# Altium project Minibot_V1.PrjPcb
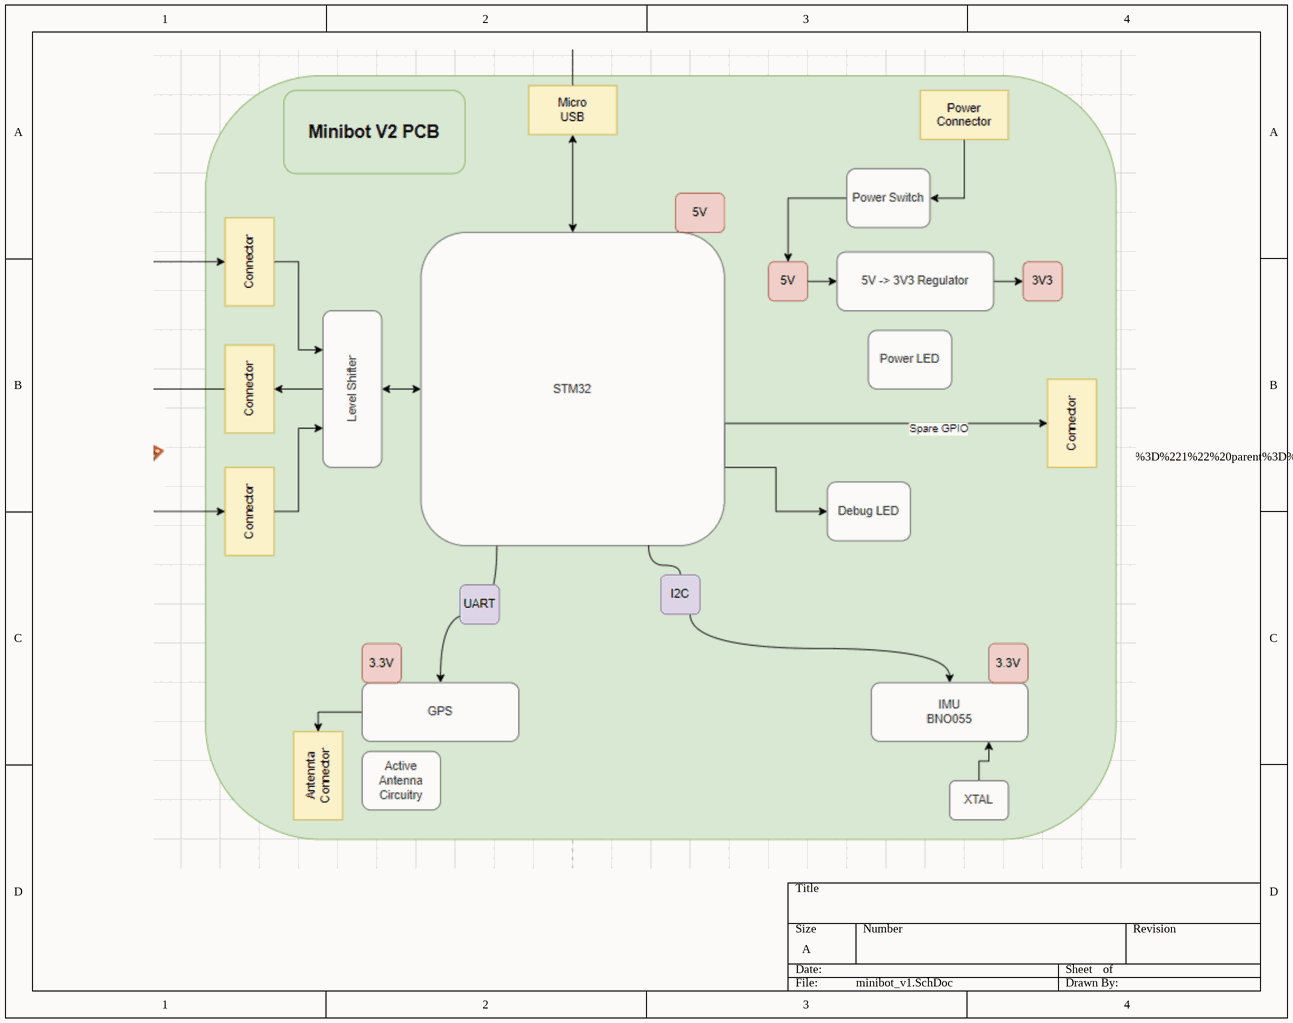
[diagram p0: minibot_v1.SchDoc]
6 sheets, 97 parts. Net scope: global (net labels, ports and power ports of the same name join across sheets).
Board file: minibot_v1.PcbDoc
Sheets:
  minibot_v1.SchDoc
  microController.SchDoc
  Connectors.SchDoc
  Sensor.SchDoc
  Power.SchDoc
  Nucleo.SchDoc

## Sheet minibot_v1.SchDoc
size A; SheetNumber: 1; SheetTotal: 4

### Notes on the sheet
- %3CmxGraphModel%3E%3Croot%3E%3CmxCell%20id%3D%220%22%2F%3E%3CmxCell%20id%3D%221%22%20parent%3D%220%22%2F%3E%3CmxCell%20id%3D%222%22%20value%3D%22%22%20style%3D%22rounded%3D1%3BwhiteSpace%3Dwrap%3Bhtml%3D1%3BfillColor%3D%23d5e8d4%3BstrokeColor%3D%2382b366%3BarcSize%3D15%3B%22%20vertex%3D%221%22%20parent%3D%221%22%3E%3CmxGeometry%20x%3D%22-375%22%20y%3D%22-820%22%20width%3D%22930%22%20height%3D%22780%22%20as%3D%22geometry%22%2F%3E%3C%2FmxCell%3E%3CmxCell%20id%3D%223%22%20style%3D%22edgeStyle%3DorthogonalEdgeStyle%3Bcurved%3D1%3BorthogonalLoop%3D1%3BjettySize%3Dauto%3Bhtml%3D1%3BexitX%3D0.25%3BexitY%3D1%3BexitDx%3D0%3BexitDy%3D0%3B%22%20edge%3D%221%22%20source%3D%229%22%20target%3D%2213%22%20parent%3D%221%22%3E%3CmxGeometry%20relative%3D%221%22%20as%3D%22geometry%22%2F%3E%3C%2FmxCell%3E%3CmxCell%20id%3D%224%22%20style%3D%22edgeStyle%3DorthogonalEdgeStyle%3Bcurved%3D1%3BorthogonalLoop%3D1%3BjettySize%3Dauto%3Bhtml%3D1%3BexitX%3D0.75%3BexitY%3D1%3BexitDx%3D0%3BexitDy%3D0%3BentryX%3D0.5%3BentryY%3D0%3BentryDx%3D0%3BentryDy%3D0%3BstartArrow%3Dnone%3B%22%20edge%3D%221%22%20source%3D%2243%22%20target%3D%2211%22%20parent%3D%221%22%3E%3CmxGeometry%20relative%3D%221%22%20as%3D%22geometry%22%2F%3E%3C%2FmxCell%3E%3CmxCell%20id%3D%225%22%20style%3D%22edgeStyle%3DorthogonalEdgeStyle%3Brounded%3D0%3BorthogonalLoop%3D1%3BjettySize%3Dauto%3Bhtml%3D1%3BexitX%3D0.5%3BexitY%3D0%3BexitDx%3D0%3BexitDy%3D0%3BentryX%3D0.5%3BentryY%3D1%3BentryDx%3D0%3BentryDy%3D0%3BstartArrow%3Dclassic%3BstartFill%3D1%3B%22%20edge%3D%221%22%20source%3D%229%22%20target%3D%2218%22%20parent%3D%221%22%3E%3CmxGeometry%20relative%3D%221%22%20as%3D%22geometry%22%2F%3E%3C%2FmxCell%3E%3CmxCell%20id%3D%226%22%20style%3D%22edgeStyle%3DorthogonalEdgeStyle%3Brounded%3D0%3BorthogonalLoop%3D1%3BjettySize%3Dauto%3Bhtml%3D1%3BexitX%3D1%3BexitY%3D0.75%3BexitDx%3D0%3BexitDy%3D0%3BentryX%3D0.5%3BentryY%3D0%3BentryDx%3D0%3BentryDy%3D0%3BstartArrow%3Dnone%3BstartFill%3D0%3B%22%20edge%3D%221%22%20source%3D%229%22%20target%3D%2237%22%20parent%3D%221%22%3E%3CmxGeometry%20relative%3D%221%22%20as%3D%22geometry%22%3E%3CArray%20as%3D%22points%22%3E%3CmxPoint%20x%3D%22155%22%20y%3D%22-465%22%2F%3E%3C%2FArray%3E%3C%2FmxGeometry%3E%3C%2FmxCell%3E%3CmxCell%20id%3D%227%22%20value%3D%22Spare%20GPIO%22%20style%3D%22edgeLabel%3Bhtml%3D1%3Balign%3Dcenter%3BverticalAlign%3Dmiddle%3Bresizable%3D0%3Bpoints%3D%5B%5D%3B%22%20connectable%3D%220%22%20vertex%3D%221%22%20parent%3D%226%22%3E%3CmxGeometry%20x%3D%220.3987%22%20y%3D%22-5%22%20relative%3D%221%22%20as%3D%22geometry%22%3E%3CmxPoint%20as%3D%22offset%22%2F%3E%3C%2FmxGeometry%3E%3C%2FmxCell%3E%3CmxCell%20id%3D%228%22%20style%3D%22edgeStyle%3DorthogonalEdgeStyle%3Brounded%3D0%3BorthogonalLoop%3D1%3BjettySize%3Dauto%3Bhtml%3D1%3BexitX%3D1%3BexitY%3D0.75%3BexitDx%3D0%3BexitDy%3D0%3B%22%20edge%3D%221%22%20source%3D%229%22%20target%3D%2239%22%20parent%3D%221%22%3E%3CmxGeometry%20relative%3D%221%22%20as%3D%22geometry%22%2F%3E%3C%2FmxCell%3E%3CmxCell%20id%3D%229%22%20value%3D%22STM32%22%20style%3D%22rounded%3D1%3BwhiteSpace%3Dwrap%3Bhtml%3D1%3BfillColor%3D%23f5f5f5%3BfontColor%3D%23333333%3BstrokeColor%3D%23666666%3B%22%20vertex%3D%221%22%20parent%3D%221%22%3E%3CmxGeometry%20x%3D%22-155%22%20y%3D%22-660%22%20width%3D%22310%22%20height%3D%22320%22%20as%3D%22geometry%22%2F%3E%3C%2FmxCell%3E%3CmxCell%20id%3D%2210%22%20value%3D%225V%22%20style%3D%22rounded%3D1%3BwhiteSpace%3Dwrap%3Bhtml%3D1%3BfillColor%3D%23f8cecc%3BstrokeColor%3D%23b85450%3B%22%20vertex%3D%221%22%20parent%3D%221%22%3E%3CmxGeometry%20x%3D%22105%22%20y%3D%22-700%22%20width%3D%2250%22%20height%3D%2240%22%20as%3D%22geometry%22%2F%3E%3C%2FmxCell%3E%3CmxCell%20id%3D%2211%22%20value%3D%22IMU%26lt%3Bbr%26gt%3BBNO055%22%20style%3D%22rounded%3D1%3BwhiteSpace%3Dwrap%3Bhtml%3D1%3BfillColor%3D%23f5f5f5%3BfontColor%3D%23333333%3BstrokeColor%3D%23666666%3B%22%20vertex%3D%221%22%20parent%3D%221%22%3E%3CmxGeometry%20x%3D%22305%22%20y%3D%22-200%22%20width%3D%22160%22%20height%3D%2260%22%20as%3D%22geometry%22%2F%3E%3C%2FmxCell%3E%3CmxCell%20id%3D%2212%22%20style%3D%22edgeStyle%3DorthogonalEdgeStyle%3Brounded%3D0%3BorthogonalLoop%3D1%3BjettySize%3Dauto%3Bhtml%3D1%3BexitX%3D0%3BexitY%3D0.5%3BexitDx%3D0%3BexitDy%3D0%3BentryX%3D1%3BentryY%3D0.5%3BentryDx%3D0%3BentryDy%3D0%3BstartArrow%3Dnone%3BstartFill%3D0%3B%22%20edge%3D%221%22%20source%3D%2213%22%20target%3D%2236%22%20parent%3D%221%22%3E%3CmxGeometry%20relative%3D%221%22%20as%3D%22geometry%22%2F%3E%3C%2FmxCell%3E%3CmxCell%20id%3D%2213%22%20value%3D%22GPS%22%20style%3D%22rounded%3D1%3BwhiteSpace%3Dwrap%3Bhtml%3D1%3BfillColor%3D%23f5f5f5%3BfontColor%3D%23333333%3BstrokeColor%3D%23666666%3B%22%20vertex%3D%221%22%20parent%3D%221%22%3E%3CmxGeometry%20x%3D%22-215%22%20y%3D%22-200%22%20width%3D%22160%22%20height%3D%2260%22%20as%3D%22geometry%22%2F%3E%3C%2FmxCell%3E%3CmxCell%20id%3D%2214%22%20value%3D%22UART%22%20style%3D%22rounded%3D1%3BwhiteSpace%3Dwrap%3Bhtml%3D1%3BfillColor%3D%23e1d5e7%3BstrokeColor%3D%239673a6%3B%22%20vertex%3D%221%22%20parent%3D%221%22%3E%3CmxGeometry%20x%3D%22-115%22%20y%3D%22-300%22%20width%3D%2240%22%20height%3D%2240%22%20as%3D%22geometry%22%2F%3E%3C%2FmxCell%3E%3CmxCell%20id%3D%2215%22%20value%3D%223.3V%22%20style%3D%22rounded%3D1%3BwhiteSpace%3Dwrap%3Bhtml%3D1%3BfillColor%3D%23f8cecc%3BstrokeColor%3D%23b85450%3B%22%20vertex%3D%221%22%20parent%3D%221%22%3E%3CmxGeometry%20x%3D%22425%22%20y%3D%22-240%22%20width%3D%2240%22%20height%3D%2240%22%20as%3D%22geometry%22%2F%3E%3C%2FmxCell%3E%3CmxCell%20id%3D%2216%22%20value%3D%223.3V%22%20style%3D%22rounded%3D1%3BwhiteSpace%3Dwrap%3Bhtml%3D1%3BfillColor%3D%23f8cecc%3BstrokeColor%3D%23b85450%3B%22%20vertex%3D%221%22%20parent%3D%221%22%3E%3CmxGeometry%20x%3D%22-215%22%20y%3D%22-240%22%20width%3D%2240%22%20height%3D%2240%22%20as%3D%22geometry%22%2F%3E%3C%2FmxCell%3E%3CmxCell%20id%3D%2217%22%20value%3D%22Connector%22%20style%3D%22rounded%3D0%3BwhiteSpace%3Dwrap%3Bhtml%3D1%3Brotation%3D-90%3BfillColor%3D%23fff2cc%3BstrokeColor%3D%23d6b656%3B%22%20vertex%3D%221%22%20parent%3D%221%22%3E%3CmxGeometry%20x%3D%22-375%22%20y%3D%22-525%22%20width%3D%2290%22%20height%3D%2250%22%20as%3D%22geometry%22%2F%3E%3C%2FmxCell%3E%3CmxCell%20id%3D%2218%22%20value%3D%22Micro%20%26lt%3Bbr%26gt%3BUSB%22%20style%3D%22rounded%3D0%3BwhiteSpace%3Dwrap%3Bhtml%3D1%3Brotation%3D0%3BfillColor%3D%23fff2cc%3BstrokeColor%3D%23d6b656%3B%22%20vertex%3D%221%22%20parent%3D%221%22%3E%3CmxGeometry%20x%3D%22-45%22%20y%3D%22-810%22%20width%3D%2290%22%20height%3D%2250%22%20as%3D%22geometry%22%2F%3E%3C%2FmxCell%3E%3CmxCell%20id%3D%2219%22%20style%3D%22edgeStyle%3DorthogonalEdgeStyle%3Brounded%3D0%3BorthogonalLoop%3D1%3BjettySize%3Dauto%3Bhtml%3D1%3BexitX%3D0.5%3BexitY%3D1%3BexitDx%3D0%3BexitDy%3D0%3BentryX%3D1%3BentryY%3D0.5%3BentryDx%3D0%3BentryDy%3D0%3B%22%20edge%3D%221%22%20source%3D%2220%22%20target%3D%2241%22%20parent%3D%221%22%3E%3CmxGeometry%20relative%3D%221%22%20as%3D%22geometry%22%2F%3E%3C%2FmxCell%3E%3CmxCell%20id%3D%2220%22%20value%3D%22Power%20Connector%22%20style%3D%22rounded%3D0%3BwhiteSpace%3Dwrap%3Bhtml%3D1%3Brotation%3D0%3BfillColor%3D%23fff2cc%3BstrokeColor%3D%23d6b656%3B%22%20vertex%3D%221%22%20parent%3D%221%22%3E%3CmxGeometry%20x%3D%22355%22%20y%3D%22-805%22%20width%3D%2290%22%20height%3D%2250%22%20as%3D%22geometry%22%2F%3E%3C%2FmxCell%3E%3CmxCell%20id%3D%2221%22%20style%3D%22edgeStyle%3DorthogonalEdgeStyle%3Brounded%3D0%3BorthogonalLoop%3D1%3BjettySize%3Dauto%3Bhtml%3D1%3BexitX%3D0.5%3BexitY%3D1%3BexitDx%3D0%3BexitDy%3D0%3BentryX%3D0.75%3BentryY%3D0%3BentryDx%3D0%3BentryDy%3D0%3B%22%20edge%3D%221%22%20source%3D%2222%22%20target%3D%2227%22%20parent%3D%221%22%3E%3CmxGeometry%20relative%3D%221%22%20as%3D%22geometry%22%2F%3E%3C%2FmxCell%3E%3CmxCell%20id%3D%2222%22%20value%3D%22Connector%22%20style%3D%22rounded%3D0%3BwhiteSpace%3Dwrap%3Bhtml%3D1%3Brotation%3D-90%3BfillColor%3D%23fff2cc%3BstrokeColor%3D%23d6b656%3B%22%20vertex%3D%221%22%20parent%3D%221%22%3E%3CmxGeometry%20x%3D%22-375%22%20y%3D%22-655%22%20width%3D%2290%22%20height%3D%2250%22%20as%3D%22geometry%22%2F%3E%3C%2FmxCell%3E%3CmxCell%20id%3D%2223%22%20style%3D%22edgeStyle%3DorthogonalEdgeStyle%3Brounded%3D0%3BorthogonalLoop%3D1%3BjettySize%3Dauto%3Bhtml%3D1%3BentryX%3D0.25%3BentryY%3D0%3BentryDx%3D0%3BentryDy%3D0%3B%22%20edge%3D%221%22%20source%3D%2224%22%20target%3D%2227%22%20parent%3D%221%22%3E%3CmxGeometry%20relative%3D%221%22%20as%3D%22geometry%22%2F%3E%3C%2FmxCell%3E%3CmxCell%20id%3D%2224%22%20value%3D%22Connector%22%20style%3D%22rounded%3D0%3BwhiteSpace%3Dwrap%3Bhtml%3D1%3Brotation%3D-90%3BfillColor%3D%23fff2cc%3BstrokeColor%3D%23d6b656%3B%22%20vertex%3D%221%22%20parent%3D%221%22%3E%3CmxGeometry%20x%3D%22-375%22%20y%3D%22-400%22%20width%3D%2290%22%20height%3D%2250%22%20as%3D%22geometry%22%2F%3E%3C%2FmxCell%3E%3CmxCell%20id%3D%2225%22%20style%3D%22edgeStyle%3DorthogonalEdgeStyle%3Brounded%3D0%3BorthogonalLoop%3D1%3BjettySize%3Dauto%3Bhtml%3D1%3BexitX%3D0.5%3BexitY%3D0%3BexitDx%3D0%3BexitDy%3D0%3B%22%20edge%3D%221%22%20source%3D%2227%22%20target%3D%2217%22%20parent%3D%221%22%3E%3CmxGeometry%20relative%3D%221%22%20as%3D%22geometry%22%2F%3E%3C%2FmxCell%3E%3CmxCell%20id%3D%2226%22%20style%3D%22edgeStyle%3DorthogonalEdgeStyle%3Brounded%3D0%3BorthogonalLoop%3D1%3BjettySize%3Dauto%3Bhtml%3D1%3BexitX%3D0.5%3BexitY%3D1%3BexitDx%3D0%3BexitDy%3D0%3BentryX%3D0%3BentryY%3D0.5%3BentryDx%3D0%3BentryDy%3D0%3BstartArrow%3Dclassic%3BstartFill%3D1%3B%22%20edge%3D%221%22%20source%3D%2227%22%20target%3D%229%22%20parent%3D%221%22%3E%3CmxGeometry%20relative%3D%221%22%20as%3D%22geometry%22%3E%3CArray%20as%3D%22points%22%3E%3CmxPoint%20x%3D%22-185%22%20y%3D%22-500%22%2F%3E%3CmxPoint%20x%3D%22-185%22%20y%3D%22-500%22%2F%3E%3C%2FArray%3E%3C%2FmxGeometry%3E%3C%2FmxCell%3E%3CmxCell%20id%3D%2227%22%20value%3D%22Level%20Shifter%22%20style%3D%22rounded%3D1%3BwhiteSpace%3Dwrap%3Bhtml%3D1%3BfillColor%3D%23f5f5f5%3BfontColor%3D%23333333%3BstrokeColor%3D%23666666%3Brotation%3D-90%3B%22%20vertex%3D%221%22%20parent%3D%221%22%3E%3CmxGeometry%20x%3D%22-305%22%20y%3D%22-530%22%20width%3D%22160%22%20height%3D%2260%22%20as%3D%22geometry%22%2F%3E%3C%2FmxCell%3E%3CmxCell%20id%3D%2228%22%20style%3D%22edgeStyle%3DorthogonalEdgeStyle%3Bcurved%3D1%3BorthogonalLoop%3D1%3BjettySize%3Dauto%3Bhtml%3D1%3BexitX%3D1%3BexitY%3D0.5%3BexitDx%3D0%3BexitDy%3D0%3BentryX%3D0%3BentryY%3D0.5%3BentryDx%3D0%3BentryDy%3D0%3B%22%20edge%3D%221%22%20source%3D%2229%22%20target%3D%2231%22%20parent%3D%221%22%3E%3CmxGeometry%20relative%3D%221%22%20as%3D%22geometry%22%2F%3E%3C%2FmxCell%3E%3CmxCell%20id%3D%2229%22%20value%3D%225V%22%20style%3D%22rounded%3D1%3BwhiteSpace%3Dwrap%3Bhtml%3D1%3BfillColor%3D%23f8cecc%3BstrokeColor%3D%23b85450%3B%22%20vertex%3D%221%22%20parent%3D%221%22%3E%3CmxGeometry%20x%3D%22200%22%20y%3D%22-630%22%20width%3D%2240%22%20height%3D%2240%22%20as%3D%22geometry%22%2F%3E%3C%2FmxCell%3E%3CmxCell%20id%3D%2230%22%20style%3D%22edgeStyle%3DorthogonalEdgeStyle%3Bcurved%3D1%3BorthogonalLoop%3D1%3BjettySize%3Dauto%3Bhtml%3D1%3BexitX%3D1%3BexitY%3D0.5%3BexitDx%3D0%3BexitDy%3D0%3BentryX%3D0%3BentryY%3D0.5%3BentryDx%3D0%3BentryDy%3D0%3B%22%20edge%3D%221%22%20source%3D%2231%22%20target%3D%2232%22%20parent%3D%221%22%3E%3CmxGeometry%20relative%3D%221%22%20as%3D%22geometry%22%2F%3E%3C%2FmxCell%3E%3CmxCell%20id%3D%2231%22%20value%3D%225V%20-%26amp%3Bgt%3B%203V3%20Regulator%22%20style%3D%22rounded%3D1%3BwhiteSpace%3Dwrap%3Bhtml%3D1%3BfillColor%3D%23f5f5f5%3BfontColor%3D%23333333%3BstrokeColor%3D%23666666%3B%22%20vertex%3D%221%22%20parent%3D%221%22%3E%3CmxGeometry%20x%3D%22270%22%20y%3D%22-640%22%20width%3D%22160%22%20height%3D%2260%22%20as%3D%22geometry%22%2F%3E%3C%2FmxCell%3E%3CmxCell%20id%3D%2232%22%20value%3D%223V3%22%20style%3D%22rounded%3D1%3BwhiteSpace%3Dwrap%3Bhtml%3D1%3BfillColor%3D%23f8cecc%3BstrokeColor%3D%23b85450%3B%22%20vertex%3D%221%22%20parent%3D%221%22%3E%3CmxGeometry%20x%3D%22460%22%20y%3D%22-630%22%20width%3D%2240%22%20height%3D%2240%22%20as%3D%22geometry%22%2F%3E%3C%2FmxCell%3E%3CmxCell%20id%3D%2233%22%20style%3D%22edgeStyle%3DorthogonalEdgeStyle%3Brounded%3D0%3BorthogonalLoop%3D1%3BjettySize%3Dauto%3Bhtml%3D1%3BexitX%3D0.5%3BexitY%3D0%3BexitDx%3D0%3BexitDy%3D0%3BentryX%3D0.75%3BentryY%3D1%3BentryDx%3D0%3BentryDy%3D0%3BstartArrow%3Dnone%3BstartFill%3D0%3B%22%20edge%3D%221%22%20source%3D%2234%22%20target%3D%2211%22%20parent%3D%221%22%3E%3CmxGeometry%20relative%3D%221%22%20as%3D%22geometry%22%2F%3E%3C%2FmxCell%3E%3CmxCell%20id%3D%2234%22%20value%3D%22XTAL%22%20style%3D%22rounded%3D1%3BwhiteSpace%3Dwrap%3Bhtml%3D1%3BfillColor%3D%23f5f5f5%3BfontColor%3D%23333333%3BstrokeColor%3D%23666666%3B%22%20vertex%3D%221%22%20parent%3D%221%22%3E%3CmxGeometry%20x%3D%22385%22%20y%3D%22-100%22%20width%3D%2260%22%20height%3D%2240%22%20as%3D%22geometry%22%2F%3E%3C%2FmxCell%3E%3CmxCell%20id%3D%2235%22%20value%3D%22Active%20Antenna%20Circuitry%22%20style%3D%22rounded%3D1%3BwhiteSpace%3Dwrap%3Bhtml%3D1%3BfillColor%3D%23f5f5f5%3BfontColor%3D%23333333%3BstrokeColor%3D%23666666%3B%22%20vertex%3D%221%22%20parent%3D%221%22%3E%3CmxGeometry%20x%3D%22-215%22%20y%3D%22-130%22%20width%3D%2280%22%20height%3D%2260%22%20as%3D%22geometry%22%2F%3E%3C%2FmxCell%3E%3CmxCell%20id%3D%2236%22%20value%3D%22Antennta%20Connector%22%20style%3D%22rounded%3D0%3BwhiteSpace%3Dwrap%3Bhtml%3D1%3Brotation%3D-90%3BfillColor%3D%23fff2cc%3BstrokeColor%3D%23d6b656%3B%22%20vertex%3D%221%22%20parent%3D%221%22%3E%3CmxGeometry%20x%3D%22-305%22%20y%3D%22-130%22%20width%3D%2290%22%20height%3D%2250%22%20as%3D%22geometry%22%2F%3E%3C%2FmxCell%3E%3CmxCell%20id%3D%2237%22%20value%3D%22Connector%22%20style%3D%22rounded%3D0%3BwhiteSpace%3Dwrap%3Bhtml%3D1%3Brotation%3D-90%3BfillColor%3D%23fff2cc%3BstrokeColor%3D%23d6b656%3B%22%20vertex%3D%221%22%20parent%3D%221%22%3E%3CmxGeometry%20x%3D%22465%22%20y%3D%22-490%22%20width%3D%2290%22%20height%3D%2250%22%20as%3D%22geometry%22%2F%3E%3C%2FmxCell%3E%3CmxCell%20id%3D%2238%22%20value%3D%22Power%20LED%22%20style%3D%22rounded%3D1%3BwhiteSpace%3Dwrap%3Bhtml%3D1%3BfillColor%3D%23f5f5f5%3BfontColor%3D%23333333%3BstrokeColor%3D%23666666%3B%22%20vertex%3D%221%22%20parent%3D%221%22%3E%3CmxGeometry%20x%3D%22302%22%20y%3D%22-560%22%20width%3D%2285%22%20height%3D%2260%22%20as%3D%22geometry%22%2F%3E%3C%2FmxCell%3E%3CmxCell%20id%3D%2239%22%20value%3D%22Debug%20LED%22%20style%3D%22rounded%3D1%3BwhiteSpace%3Dwrap%3Bhtml%3D1%3BfillColor%3D%23f5f5f5%3BfontColor%3D%23333333%3BstrokeColor%3D%23666666%3B%22%20vertex%3D%221%22%20parent%3D%221%22%3E%3CmxGeometry%20x%3D%22260%22%20y%3D%22-405%22%20width%3D%2285%22%20height%3D%2260%22%20as%3D%22geometry%22%2F%3E%3C%2FmxCell%3E%3CmxCell%20id%3D%2240%22%20style%3D%22edgeStyle%3DorthogonalEdgeStyle%3Brounded%3D0%3BorthogonalLoop%3D1%3BjettySize%3Dauto%3Bhtml%3D1%3BexitX%3D0%3BexitY%3D0.5%3BexitDx%3D0%3BexitDy%3D0%3BentryX%3D0.5%3BentryY%3D0%3BentryDx%3D0%3BentryDy%3D0%3B%22%20edge%3D%221%22%20source%3D%2241%22%20target%3D%2229%22%20parent%3D%221%22%3E%3CmxGeometry%20relative%3D%221%22%20as%3D%22geometry%22%2F%3E%3C%2FmxCell%3E%3CmxCell%20id%3D%2241%22%20value%3D%22Power%20Switch%22%20style%3D%22rounded%3D1%3BwhiteSpace%3Dwrap%3Bhtml%3D1%3BfillColor%3D%23f5f5f5%3BfontColor%3D%23333333%3BstrokeColor%3D%23666666%3B%22%20vertex%3D%221%22%20parent%3D%221%22%3E%3CmxGeometry%20x%3D%22280%22%20y%3D%22-725%22%20width%3D%2285%22%20height%3D%2260%22%20as%3D%22geometry%22%2F%3E%3C%2FmxCell%3E%3CmxCell%20id%3D%2242%22%20value%3D%22%22%20style%3D%22edgeStyle%3DorthogonalEdgeStyle%3Bcurved%3D1%3BorthogonalLoop%3D1%3BjettySize%3Dauto%3Bhtml%3D1%3BexitX%3D0.75%3BexitY%3D1%3BexitDx%3D0%3BexitDy%3D0%3BentryX%3D0.5%3BentryY%3D0%3BentryDx%3D0%3BentryDy%3D0%3BendArrow%3Dnone%3B%22%20edge%3D%221%22%20source%3D%229%22%20target%3D%2243%22%20parent%3D%221%22%3E%3CmxGeometry%20relative%3D%221%22%20as%3D%22geometry%22%3E%3CmxPoint%20x%3D%2277.5%22%20y%3D%22-340%22%20as%3D%22sourcePoint%22%2F%3E%3CmxPoint%20x%3D%22385%22%20y%3D%22-200%22%20as%3D%22targetPoint%22%2F%3E%3C%2FmxGeometry%3E%3C%2FmxCell%3E%3CmxCell%20id%3D%2243%22%20value%3D%22I2C%22%20style%3D%22rounded%3D1%3BwhiteSpace%3Dwrap%3Bhtml%3D1%3BfillColor%3D%23e1d5e7%3BstrokeColor%3D%239673a6%3B%22%20vertex%3D%221%22%20parent%3D%221%22%3E%3CmxGeometry%20x%3D%2290%22%20y%3D%22-310%22%20width%3D%2240%22%20height%3D%2240%22%20as%3D%22geometry%22%2F%3E%3C%2FmxCell%3E%3CmxCell%20id%3D%2244%22%20value%3D%22%26lt%3Bfont%20style%3D%26quot%3Bfont-size%3A%2018px%3B%26quot%3B%26gt%3B%26lt%3Bb%26gt%3BMinibot%20V2%20PCB%26lt%3B%2Fb%26gt%3B%26lt%3B%2Ffont%26gt%3B%22%20style%3D%22rounded%3D1%3BwhiteSpace%3Dwrap%3Bhtml%3D1%3BfillColor%3D%23d5e8d4%3BstrokeColor%3D%2382b366%3B%22%20vertex%3D%221%22%20parent%3D%221%22%3E%3CmxGeometry%20x%3D%22-295%22%20y%3D%22-805%22%20width%3D%22185%22%20height%3D%2285%22%20as%3D%22geometry%22%2F%3E%3C%2FmxCell%3E%3C%2Froot%3E%3C%2FmxGraphModel%3E

## Sheet microController.SchDoc
size A; SheetNumber: 2; SheetTotal: 5
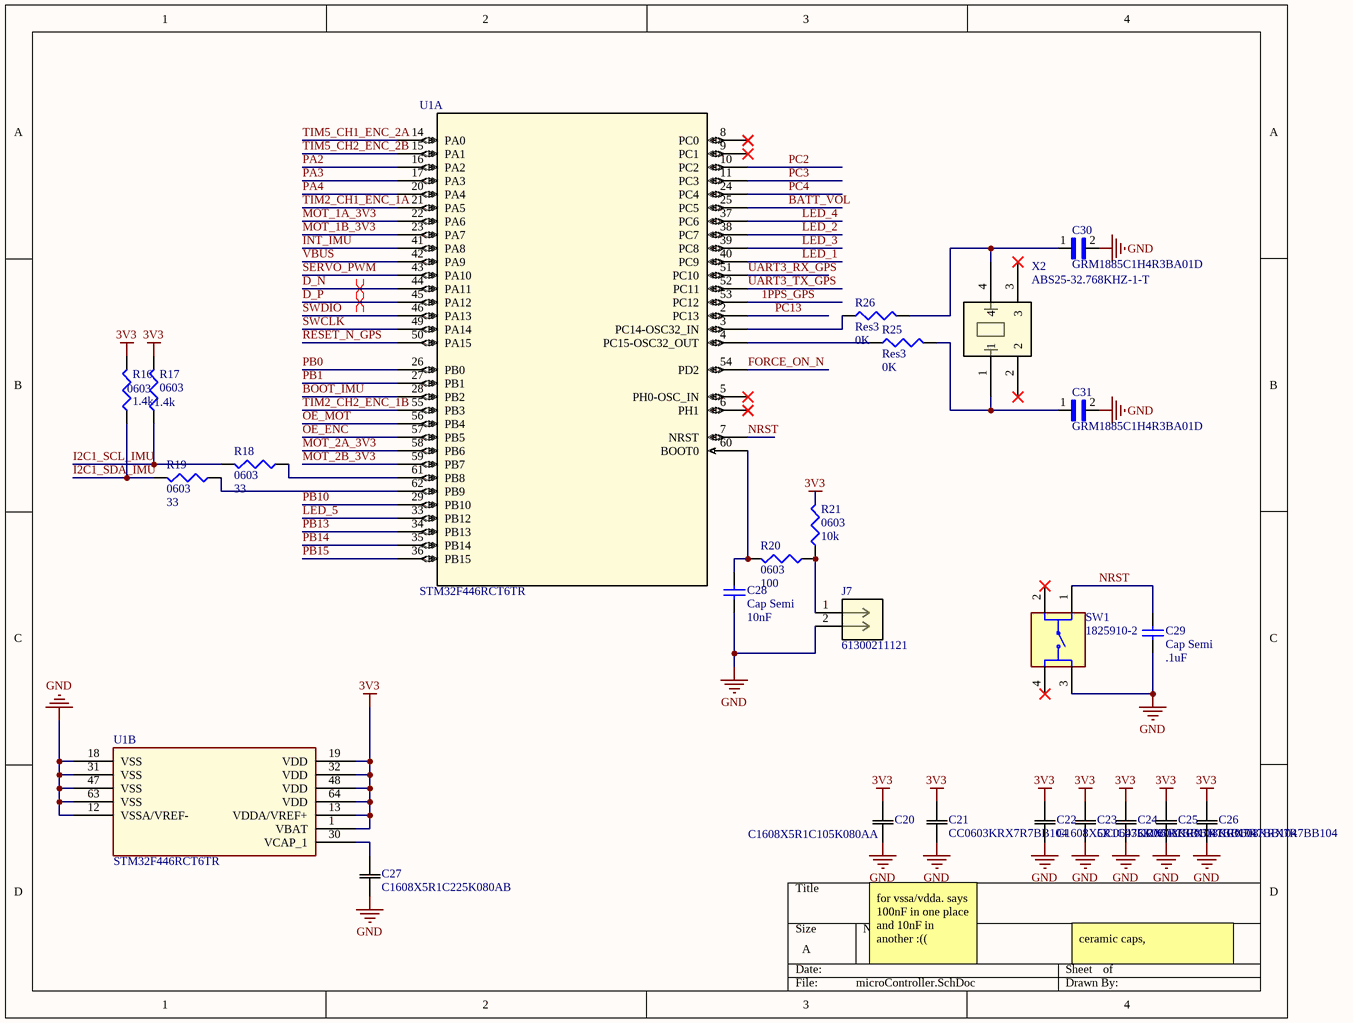
[diagram p1: microController.SchDoc]

### Parts
C20  C1608X5R1C105K080AA  [CAP_1608_TDK]
C21  CC0603KRX7R7BB104  [CC0603N_YAG]
C22  C1608X5R1C475K080AC  [CAP_1608_TDK]
C23  CC0603KRX7R7BB104  [CC0603N_YAG]
C24  CC0603KRX7R7BB104  [CC0603N_YAG]
C25  CC0603KRX7R7BB104  [CC0603N_YAG]
C26  CC0603KRX7R7BB104  [CC0603N_YAG]
C27  C1608X5R1C225K080AB  [CAP_1608_TDK]
C28  Cap Semi  value 10nF  [1608[0603]]
C29  Cap Semi  value .1uF  [1608[0603]]
C30  GRM1885C1H4R3BA01D  [CAPC1608X90N]
C31  GRM1885C1H4R3BA01D  [CAPC1608X90N]
J7  61300211121  [CONN_61300211121_WRE]
R16  0603  value 1.4k  [J1-0603]
R17  0603  value 1.4k  [J1-0603]
R18  0603  value 33  [J1-0603]
R19  0603  value 33  [J1-0603]
R20  0603  value 100  [J1-0603]
R21  0603  value 10k  [J1-0603]
R25  Res3  value 0K  [J1-0603]
R26  Res3  value 0K  [J1-0603]
SW1  1825910-2  [TE_1825910-2]
U1  STM32F446RCT6TR  [LQFP64-10x10mm]  (parts A,B of 2)
X2  ABS25-32.768KHZ-1-T  [ABS25-32.768KHZ-1-T_ABR]

### Nets
3V3: C20.2 C21.2 C22.2 C23.2 C24.2 C25.2 C26.2 R16.2 R17.2 R21.2 U1.1(VBAT) U1.13(VDDA/VREF+) U1.19(VDD) U1.32(VDD) U1.48(VDD) U1.64(VDD)
GND: C20.1 C21.1 C22.1 C23.1 C24.1 C25.1 C26.1 C27.1 C28.1 C29.1 C30.2 C31.2 J7.2 SW1.3 U1.12(VSSA/VREF-) U1.18(VSS) U1.31(VSS) U1.47(VSS) U1.63(VSS)
1PPS_GPS: U1.53(PC12)
BATT_VOL: U1.25(PC5)
BOOT_IMU: U1.28(PB2)
D_N: U1.44(PA11)
D_P: U1.45(PA12)
FORCE_ON_N: U1.54(PD2)
I2C1_SCL_IMU: R17.1 R18.2
I2C1_SDA_IMU: R16.1 R19.2
INT_IMU: U1.41(PA8)
LED_1: U1.40(PC9)
LED_2: U1.38(PC7)
LED_3: U1.39(PC8)
LED_4: U1.37(PC6)
LED_5: U1.33(PB12)
MOT_1A_3V3: U1.22(PA6)
MOT_1B_3V3: U1.23(PA7)
MOT_2A_3V3: U1.58(PB6)
MOT_2B_3V3: U1.59(PB7)
NRST: C29.2 SW1.1 U1.7(NRST)
OE_ENC: U1.57(PB5)
OE_MOT: U1.56(PB4)
PA2: U1.16(PA2)
PA3: U1.17(PA3)
PA4: U1.20(PA4)
PB0: U1.26(PB0)
PB1: U1.27(PB1)
PB10: U1.29(PB10)
PB13: U1.34(PB13)
PB14: U1.35(PB14)
PB15: U1.36(PB15)
PC2: U1.10(PC2)
PC3: U1.11(PC3)
PC4: U1.24(PC4)
PC13: U1.2(PC13)
RESET_N_GPS: U1.50(PA15)
SERVO_PWM: U1.43(PA10)
SWCLK: U1.49(PA14)
SWDIO: U1.46(PA13)
TIM2_CH1_ENC_1A: U1.21(PA5)
TIM2_CH2_ENC_1B: U1.55(PB3)
TIM5_CH1_ENC_2A: U1.14(PA0)
TIM5_CH2_ENC_2B: U1.15(PA1)
UART3_RX_GPS: U1.51(PC10)
UART3_TX_GPS: U1.52(PC11)
VBUS: U1.42(PA9)
NetC27_2: C27.2 U1.30(VCAP_1)
NetC28_2: C28.2 R20.2 U1.60(BOOT0)
NetC30_1: C30.1 R26.2 X2.4
NetC31_1: C31.1 R25.2 X2.1
NetJ7_1: J7.1 R20.1 R21.1
NetR18_1: R18.1 U1.61(PB8)
NetR19_1: R19.1 U1.62(PB9)
NetR25_1: R25.1 U1.4(PC15-OSC32_OUT)
NetR26_1: R26.1 U1.3(PC14-OSC32_IN)

Not connected (* = marked no-connect by the designer): SW1 2* 4*; U1 5(PH0-OSC_IN)* 6(PH1)* 8(PC0)* 9(PC1)*; X2 2* 3*

### Layout directives
differential pair: D_N, D_P

### Notes on the sheet
- for vssa/vdda. says 100nF in one place and 10nF in another :((
- ceramic caps,

### Library data of the parts
C20 = C1608X5R1C105K080AA: No Description Available; Mfr_Name: TDK; Type: DEV; Copyright: Copyright (C) 2023 Ultra Librarian. All rights reserved.; Manufacturer_Part_Number: C1608X5R1C105K080AA; Digi-Key_Part_Number_1: 445-1416-1-ND; Digi-Key_Part_Number_2: 445-1416-2-ND; Digi-Key_Part_Number_3: 445-1416-6-ND; RefDes: RefDes
C21 C23-C26 = CC0603KRX7R7BB104: No Description Available; Mfr_Name: Yageo; Type: DEV; Copyright: Copyright (C) 2023 Ultra Librarian. All rights reserved.; Manufacturer_Part_Number: CC0603KRX7R7BB104; Digi-Key_Part_Number_1: 311-1088-1-ND; Digi-Key_Part_Number_2: 311-1088-2-ND; Digi-Key_Part_Number_3: 311-1088-2-NDL; Digi-Key_Part_Number_4: 311-1088-6-ND; RefDes: RefDes
C22 = C1608X5R1C475K080AC: No Description Available; Mfr_Name: TDK; Type: DEV; Copyright: Copyright (C) 2023 Ultra Librarian. All rights reserved.; Manufacturer_Part_Number: C1608X5R1C475K080AC; Digi-Key_Part_Number_1: 445-7478-1-ND; Digi-Key_Part_Number_2: 445-7478-2-ND; Digi-Key_Part_Number_3: 445-7478-6-ND; RefDes: RefDes
C27 = C1608X5R1C225K080AB: No Description Available; Mfr_Name: TDK; Type: DEV; Copyright: Copyright (C) 2023 Ultra Librarian. All rights reserved.; Manufacturer_Part_Number: C1608X5R1C225K080AB; Digi-Key_Part_Number_1: 445-5157-1-ND; Digi-Key_Part_Number_2: 445-5157-2-ND; Digi-Key_Part_Number_3: 445-5157-6-ND; RefDes: RefDes
C28 C29 = Cap Semi: Capacitor (Semiconductor SIM Model); Published: 8-Jun-2000; LatestRevisionDate: 29-May-2009; LatestRevisionNote: IPC-7351 Footprint Added.; PackageReference: C1206; Publisher: Altium Limited; PackageDescription: Chip Capacitor
C30 C31 = GRM1885C1H4R3BA01D: SMD Capacitor C0G(EIA) with Capacitance: 4.3pF Tol. 0.1pF. Rated Voltage: 50Vdc; MF: Murata; MP: GRM1885C1H4R3BA01D; Value: *; Package: 1608 Murata; Price: None; Check_prices: https://www.snapeda.com/parts/GRM1885C1H4R3BA01D/Murata%20Electronics%20North%20America/view-part/1775789/?ref=eda; SnapEDA_Link: https://www.snapeda.com/parts/GRM1885C1H4R3BA01D/Murata%20Electronics%20North%20America/view-part/1775789/?ref=snap; Availability: Unavailable
J7 = 61300211121: No Description Available; Mfr_Name: Wurth Electronics; Copyright: Copyright (C) 2023 Ultra Librarian. All rights reserved.; Manufacturer_Part_Number: 61300211121; RefDes: RefDes; Type: DEV
R16-R21 R25 R26 = Res3: Resistor; Published: 8-Jun-2000; LatestRevisionDate: 29-May-2009; LatestRevisionNote: IPC-7351 Footprint Added.; PackageReference: J1-0603; Publisher: Altium Limited; PackageDescription: Chip Resistor
SW1 = 1825910-2: 50 mA SPST Round Actuator 160 Gram Force Tactile Pushbutton Switch; MF: TE Connectivity; Check_prices: https://www.snapeda.com/parts/1825910-2/TE+Connectivity+ALCOSWITCH+Switches/view-part/?ref=eda; Value: *; Availability: In Stock; MP: 1825910-2; Price: None; Package: None; SnapEDA_Link: https://www.snapeda.com/parts/1825910-2/TE+Connectivity+ALCOSWITCH+Switches/view-part/?ref=snap; Purchase-URL: https://pricing.snapeda.com/search/part/1825910-2/?ref=eda; EU_RoHS_Compliance: Compliant
U1 = STM32F446RCT6TR: No Description Available; Mfr_Name: STMicroelectronics; Copyright: Copyright (C) 2023 Ultra Librarian. All rights reserved.; Manufacturer_Part_Number: STM32F446RCT6TR; Digi-Key_Part_Number_1: 497-19357-2-ND; Digi-Key_Part_Number_2: 497-19357-1-ND; Digi-Key_Part_Number_3: 497-19357-6-ND; RefDes: RefDes; Type: DEV
X2 = ABS25-32.768KHZ-1-T: No Description Available; Mfr_Name: Abracon; Copyright: Copyright (C) 2023 Ultra Librarian. All rights reserved.; Manufacturer_Part_Number: ABS25-32.768KHZ-1-T; RefDes: RefDes; Type: DEV

## Sheet Connectors.SchDoc
size A; SheetNumber: 1; SheetTotal: 6
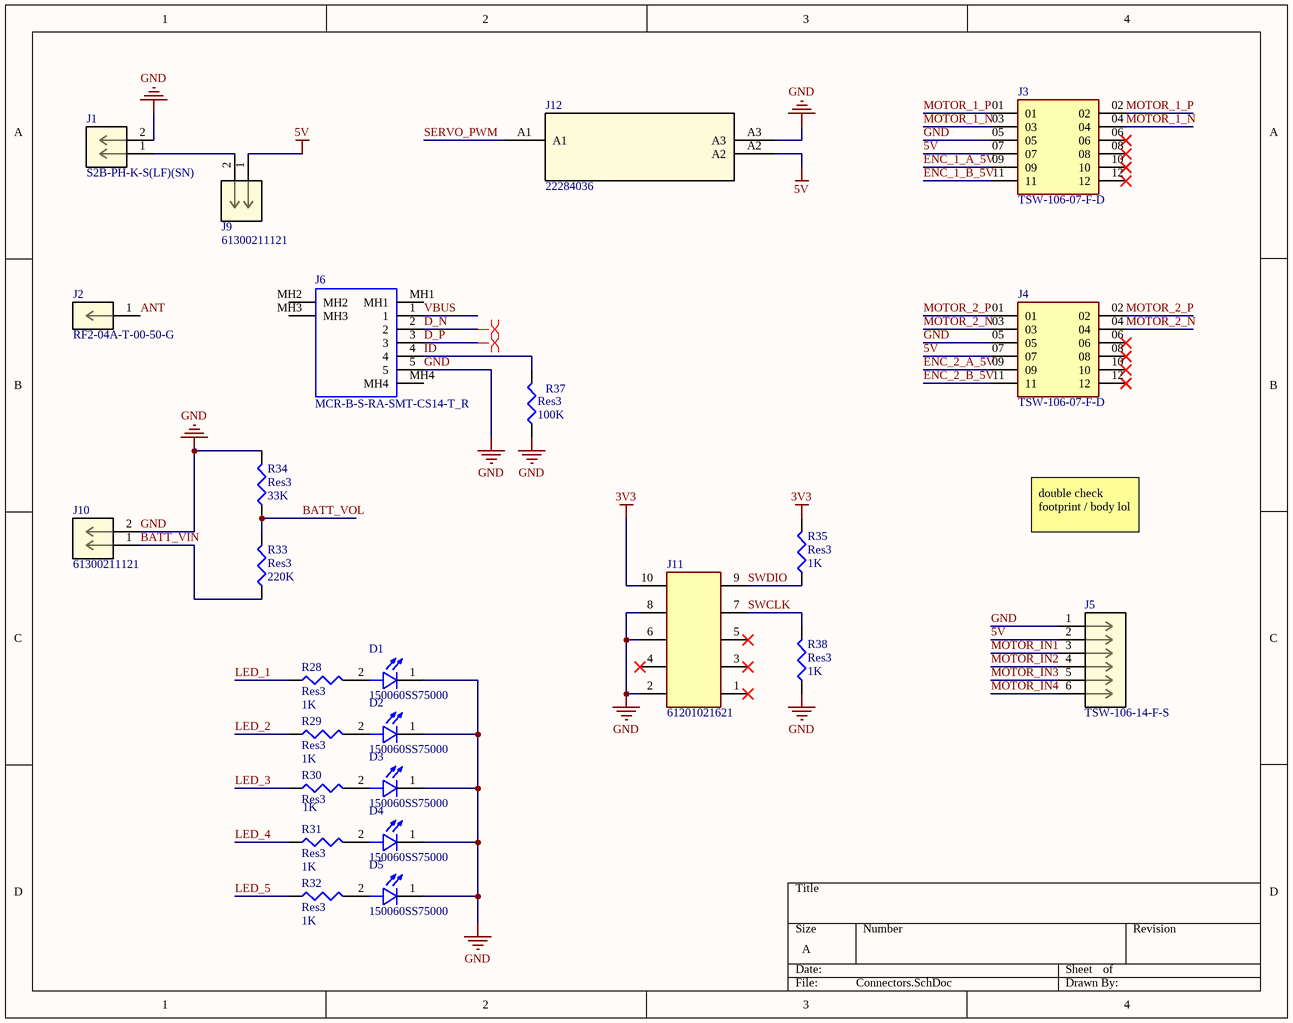
[diagram p2: Connectors.SchDoc]

### Parts
D1  150060SS75000  [LED_150060SS75000]
D2  150060SS75000  [LED_150060SS75000]
D3  150060SS75000  [LED_150060SS75000]
D4  150060SS75000  [LED_150060SS75000]
D5  150060SS75000  [LED_150060SS75000]
J1  S2B-PH-K-S(LF)(SN)  [CONN_S2B-PH-K-S_JST]
J2  RF2-04A-T-00-50-G  [CONN_RF2-04A-T-00-50-G_ADM]
J3  TSW-106-07-F-D  [SAMTEC_TSW-106-07-F-D]
J4  TSW-106-07-F-D  [SAMTEC_TSW-106-07-F-D]
J5  TSW-106-14-F-S  [CON6_1X6_TU_TSW]
J6  MCR-B-S-RA-SMT-CS14-T_R  [MCRBSRASMTCS14TR]
J9  61300211121  [CONN_61300211121_WRE]
J10  61300211121  [CONN_61300211121_WRE]
J11  61201021621  [61201021621]
J12  22284036  [22-28-4036_MOL]
R28  Res3  value 1K  [J1-0603]
R29  Res3  value 1K  [J1-0603]
R30  Res3  value 1K  [J1-0603]
R31  Res3  value 1K  [J1-0603]
R32  Res3  value 1K  [J1-0603]
R33  Res3  value 220K  [J1-0603]
R34  Res3  value 33K  [J1-0603]
R35  Res3  value 1K  [J1-0603]
R37  Res3  value 100K  [J1-0603]
R38  Res3  value 1K  [J1-0603]

### Nets
3V3: J11.10 R35.2
5V: J3.07 J4.07 J5.2 J9.1 J12.A2
GND: D1.1(C) D2.1(C) D3.1(C) D4.1(C) D5.1(C) J1.2 J3.05 J4.05 J5.1 J6.5 J10.2 J11.2 J11.6 J11.8 J12.A3 R34.2 R37.1 R38.1
ANT: J2.1
BATT_VIN: J10.1 R33.1
BATT_VOL: R33.2 R34.1
D_N: J6.2
D_P: J6.3
ENC_1_A_5V: J3.09
ENC_1_B_5V: J3.11
ENC_2_A_5V: J4.09
ENC_2_B_5V: J4.11
ID: J6.4 R37.2
LED_1: R28.1
LED_2: R29.1
LED_3: R30.1
LED_4: R31.1
LED_5: R32.1
MOTOR_1_N: J3.03 J3.04
MOTOR_1_P: J3.01 J3.02
MOTOR_2_N: J4.03 J4.04
MOTOR_2_P: J4.01 J4.02
MOTOR_IN1: J5.3
MOTOR_IN2: J5.4
MOTOR_IN3: J5.5
MOTOR_IN4: J5.6
SERVO_PWM: J12.A1
SWCLK: J11.7 R38.2
SWDIO: J11.9 R35.1
VBUS: J6.1
NetD1_2: D1.2(A) R28.2
NetD2_2: D2.2(A) R29.2
NetD3_2: D3.2(A) R30.2
NetD4_2: D4.2(A) R31.2
NetD5_2: D5.2(A) R32.2
NetJ1_1: J1.1 J9.2

Not connected (* = marked no-connect by the designer): J3 06* 08* 10* 12*; J4 06* 08* 10* 12*; J6 MH1 MH2 MH3 MH4; J11 1* 3* 4* 5*

### Layout directives
differential pair: D_N, D_P

### Notes on the sheet
- double check footprint / body lol

### Library data of the parts
D1-D5 = 150060SS75000: Standard LEDs - SMD WL-SMCW SMDMono TpVw Waterclr 0603 SprRed; MF: WÃ¼rth Elektronik; SnapEDA_Link: https://www.snapeda.com/parts/150060SS75000/W%C3%BCrth%20Elektronik/view-part/4805427/?ref=snap; Availability: Warning; Purchase-URL: https://pricing.snapeda.com/search/part/150060SS75000/?ref=eda; MP: 150060SS75000; Value: *; Price: None; Package: None; Check_prices: https://www.snapeda.com/parts/150060SS75000/W%C3%BCrth%20Elektronik/view-part/4805427/?ref=eda
J1 = S2B-PH-K-S(LF)(SN): No Description Available; Mfr_Name: JST; Copyright: Copyright (C) 2023 Ultra Librarian. All rights reserved.; Manufacturer_Part_Number: S2B-PH-K-S(LF)(SN); Digi-Key_Part_Number_1: 455-1719-ND; Digi-Key_Part_Number_2: 455-1719-NDL; RefDes: RefDes; Type: DEV
J2 = RF2-04A-T-00-50-G: No Description Available; Mfr_Name: ADAM TECHNOLOGIES INC; Copyright: Copyright (C) 2023 Ultra Librarian. All rights reserved.; Manufacturer_Part_Number: RF2-04A-T-00-50-G; Digi-Key_Part_Number_1: 2057-RF2-04A-T-00-50-G-ND; RefDes: RefDes; Type: DEV
J3 J4 = TSW-106-07-F-D: MF: Samtec; MP: TSW-106-07-F-D; Price: None; Package: None; Value: *; Availability: Unavailable
J5 = TSW-106-14-F-S: No Description Available; Mfr_Name: Samtec Inc; Copyright: Copyright (C) 2023 Ultra Librarian. All rights reserved.; Manufacturer_Part_Number: TSW-106-14-F-S; Digi-Key_Part_Number_1: SAM15379-ND; Digi-Key_Part_Number_2: TSW-106-14-F-S-ND; RefDes: RefDes; Type: DEV
J6 = MCR-B-S-RA-SMT-CS14-T_R: USB - micro B Receptacle Connector 5 Position Surface Mount, Right Angle; Manufacturer_Name: Adam Tech; Manufacturer_Part_Number: MCR-B-S-RA-SMT-CS14-T/R; Geometry.Height: 3.1mm; Mouser Part Number: *; Mouser Price/Stock: *; Arrow Part Number: MCR-B-S-RA-SMT-CS14-T/R; Arrow Price/Stock: https://www.arrow.com/en/products/mcr-b-s-ra-smt-cs14-tr/adam-tech?region=nac; Mouser Testing Part Number: *; Mouser Testing Price/Stock: *; Datasheet Link: https://app.adam-tech.com/products/download/data_sheet/195344/mcr-b-s-ra-smt-cs14-t-r-data-sheet.pdf
J9 J10 = 61300211121: as J7 on sheet microController; Copyright: Copyright (C) 2023 Ultra Librarian. All rights reserved.; Manufacturer_Part_Number: 61300211121; RefDes: RefDes; Type: DEV
J11 = 61201021621: Connector Header Through Hole 10 position 0.100 _2.54mm_; MF: Wurth Electronics; Price: None; Package: None; Value: *; MP: 61201021621; Availability: Unavailable; SnapEDA_Link: https://www.snapeda.com/parts/61201021621/Wurth%20Electronics%20Inc./view-part/1156232/?ref=snap
J12 = 22284036: No Description Available; Mfr_Name: Molex Connector Corporation; Copyright: Copyright (C) 2023 Ultra Librarian. All rights reserved.; Manufacturer_Part_Number: 22284036; RefDes: RefDes; Type: DEV
R28-R35 R37 R38 = Res3: Resistor; Published: 8-Jun-2000; LatestRevisionDate: 29-May-2009; LatestRevisionNote: IPC-7351 Footprint Added.; PackageReference: J1-0603; Publisher: Altium Limited; PackageDescription: Chip Resistor

## Sheet Sensor.SchDoc
size A; SheetNumber: 4; SheetTotal: 6
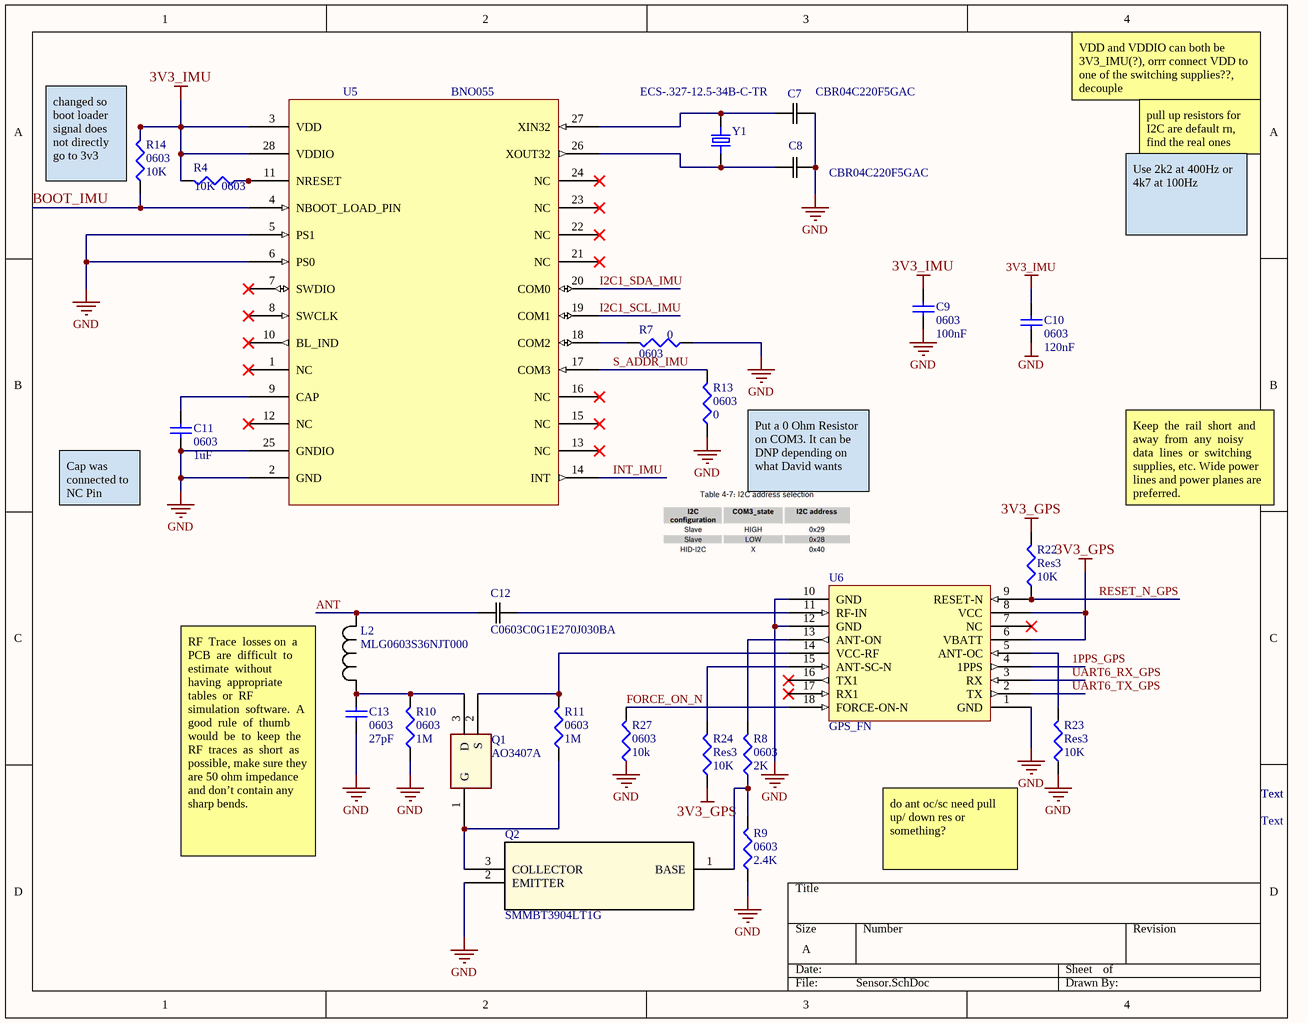
[diagram p3: Sensor.SchDoc]

### Parts
C7  CBR04C220F5GAC  [CAPC10555_55N_KEM]
C8  CBR04C220F5GAC  [CAPC10555_55N_KEM]
C9  0603  value 100nF  [1608[0603]]
C10  0603  value 120nF  [1608[0603]]
C11  0603  value 1uF  [1608[0603]]
C12  C0603C0G1E270J030BA  [CAP_0603_TDK]
C13  0603  value 27pF  [1608[0603]]
L2  MLG0603S36NJT000  [IND_0603_TDK]
Q1  AO3407A  [SOT-23-3L_AOS]
Q2  SMMBT3904LT1G  [SOT-23-3_1P4X3P040_ONS]
R4  0603  value 10K  [J1-0603]
R7  0603  value 0  [J1-0603]
R8  0603  value 2K  [J1-0603]
R9  0603  value 2.4K  [J1-0603]
R10  0603  value 1M  [J1-0603]
R11  0603  value 1M  [J1-0603]
R13  0603  value 0  [J1-0603]
R14  0603  value 10K  [J1-0603]
R22  Res3  value 10K  [J1-0603]
R23  Res3  value 10K  [J1-0603]
R24  Res3  value 10K  [J1-0603]
R27  0603  value 10k  [J1-0603]
U5  BNO055  [QFN_BNO055_BOS]
U6  GPS_FN  [SL871]
Y1  ECS-.327-12.5-34B-C-TR  [XTAL_ECS-.327-12.5-34B-C-TR]

### Nets
3V3_GPS: R22.2 R24.1 U6.6(VBATT) U6.8(VCC)
3V3_IMU: C9.2 C10.2 R4.2 R14.2 U5.3(VDD) U5.28(VDDIO)
GND: C7.2 C8.2 C9.1 C10.1 C11.1 C13.1 Q2.2(EMITTER) R7.1 R9.1 R10.1 R13.1 R23.1 U5.2(GND) U5.5(PS1) U5.6(PS0) U5.25(GNDIO) U6.1(GND) U6.10(GND) U6.12(GND)
1PPS_GPS: U6.4(1PPS)
ANT: C12.1 L2.1
BOOT_IMU: R14.1 U5.4(NBOOT_LOAD_PIN)
FORCE_ON_N: R27.2 U6.18(FORCE-ON-N)
I2C1_SCL_IMU: U5.19(COM1)
I2C1_SDA_IMU: U5.20(COM0)
INT_IMU: U5.14(INT)
RESET_N_GPS: R22.1 U6.9(RESET-N)
S_ADDR_IMU: R13.2 U5.17(COM3)
UART6_RX_GPS: U6.3(RX)
UART6_TX_GPS: U6.2(TX)
NetC7_1: C7.1 U5.27(XIN32) Y1.2
NetC8_1: C8.1 U5.26(XOUT32) Y1.1
NetC11_2: C11.2 U5.9(CAP)
NetC12_2: C12.2 U6.11(RF-IN)
NetC13_2: C13.2 L2.2 Q1.3(D) R10.2
NetQ1_1: Q1.1(G) Q2.3(COLLECTOR) R11.1
NetQ1_2: Q1.2(S) R11.2 U6.14(VCC-RF)
NetQ2_1: Q2.1(BASE) R8.1 R9.2
NetR4_1: R4.1 U5.11(NRESET)
NetR7_2: R7.2 U5.18(COM2)
NetR8_2: R8.2 U6.13(ANT-ON)
NetR23_2: R23.2 U6.5(ANT-OC)
NetR24_2: R24.2 U6.15(ANT-SC-N)

Not connected (* = marked no-connect by the designer): R27 1; U5 1(NC)* 7(SWDIO)* 8(SWCLK)* 10(BL_IND)* 12(NC)* 13(NC)* 15(NC)* 16(NC)* 21(NC)* 22(NC)* 23(NC)* 24(NC)*; U6 7(NC)* 16(TX1)* 17(RX1)*

### Notes on the sheet
- VDD and VDDIO can both be 3V3_IMU(?), orrr connect VDD to one of the switching supplies??, decouple
- pull up resistors for I2C are default rn, find the real ones
- (near R14) changed so boot loader signal does not directly go to 3v3
- Use 2k2 at 400Hz or 4k7 at 100Hz
- (near C11) Cap was connected to NC Pin
- (near R13) Put a 0 Ohm Resistor on COM3. It can be DNP depending on what David wants
- Keep  the  rail  short  and  away  from  any  noisy  data  lines  or  switching  supplies, etc. Wide power lines and power planes are preferred.
- Text
- RF  Trace  losses on  a  PCB  are  difficult  to  estimate  without  having  appropriate  tables  or  RF  simulation  software.  A  good  rule  of  thumb  would  be  to  keep  the  RF  traces  as  short  as  possible, make sure they are 50 ohm impedance and don’t contain any sharp bends.
- (near R23) do ant oc/sc need pull up/ down res or something?
- Labels drawn without touching a wire or pin: GND

### Library data of the parts
C7 C8 = CBR04C220F5GAC: No Description Available; Mfr_Name: Kemet; Type: DEV; Copyright: Copyright (C) 2023 Ultra Librarian. All rights reserved.; Manufacturer_Part_Number: CBR04C220F5GAC; Digi-Key_Part_Number_1: 399-8827-1-ND; Digi-Key_Part_Number_2: 399-8827-2-ND; Digi-Key_Part_Number_3: 399-8827-6-ND; RefDes: RefDes
C9-C11 C13 = Cap Semi: Capacitor (Semiconductor SIM Model); Published: 8-Jun-2000; LatestRevisionDate: 29-May-2009; LatestRevisionNote: IPC-7351 Footprint Added.; PackageReference: C1206; Publisher: Altium Limited; PackageDescription: Chip Capacitor
C12 = C0603C0G1E270J030BA: No Description Available; Mfr_Name: TDK; Type: DEV; Copyright: Copyright (C) 2023 Ultra Librarian. All rights reserved.; Manufacturer_Part_Number: C0603C0G1E270J030BA; Digi-Key_Part_Number_1: 445-4661-1-ND; Digi-Key_Part_Number_2: 445-4661-2-ND; Digi-Key_Part_Number_3: 445-4661-6-ND; RefDes: RefDes
L2 = MLG0603S36NJT000: No Description Available; Mfr_Name: TDK; Type: DEV; Copyright: Copyright (C) 2023 Ultra Librarian. All rights reserved.; Manufacturer_Part_Number: MLG0603S36NJT000; Digi-Key_Part_Number_1: 445-6298-1-ND; Digi-Key_Part_Number_2: 445-6298-2-ND; Digi-Key_Part_Number_3: 445-6298-6-ND; RefDes: RefDes
Q1 = AO3407A: No Description Available; Mfr_Name: Alpha and Omega Semiconductor; Type: DEV; Copyright: Copyright (C) 2023 Ultra Librarian. All rights reserved.; Manufacturer_Part_Number: AO3407A; Digi-Key_Part_Number_1: 785-1006-2-ND; Digi-Key_Part_Number_2: 785-1006-1-ND; Digi-Key_Part_Number_3: 785-1006-6-ND; Digi-Key_Part_Number_4: 785-1006-2-NDL; RefDes: RefDes
Q2 = SMMBT3904LT1G: No Description Available; Mfr_Name: onsemi; Type: DEV; Copyright: Copyright (C) 2023 Ultra Librarian. All rights reserved.; Manufacturer_Part_Number: SMMBT3904LT1G; Digi-Key_Part_Number_1: SMMBT3904LT1GOSTR-ND; Digi-Key_Part_Number_2: SMMBT3904LT1GOSCT-ND; Digi-Key_Part_Number_3: SMMBT3904LT1GOSDKR-ND; RefDes: RefDes
R4 R7-R11 R13 R14 R22-R24 R27 = Res3: Resistor; Published: 8-Jun-2000; LatestRevisionDate: 29-May-2009; LatestRevisionNote: IPC-7351 Footprint Added.; PackageReference: J1-0603; Publisher: Altium Limited; PackageDescription: Chip Resistor
U5 = BNO055: No Description Available; Mfr_Name: Bosch Sensortec; Copyright: Copyright (C) 2023 Ultra Librarian. All rights reserved.; Manufacturer_Part_Number: BNO055; Digi-Key_Part_Number_1: 828-1058-1-ND; Digi-Key_Part_Number_2: 828-1058-2-ND; Digi-Key_Part_Number_3: 828-1058-6-ND; RefDes: RefDes; Type: DEV
Y1 = ECS-.327-12.5-34B-C-TR: 32.768kHz Â±10ppm Crystal 12.5pF 70 kOhms 2-SMD, No Lead; MF: ECS Inc.; Digi-Key_Part_Number: XC1968CT-ND; Package: SMD-2 ECS International; DigiKey-Purchase-URL: https://snapeda.com/shop?store=DigiKey&id=55051; MP: ECS-.327-12.5-34B-C-TR; SnapEDA_Link: https://www.snapeda.com/parts/ECS-.327-12.5-34B-C-TR/ECS%20Inc./view-part/55051/?ref=snap; Value: *

## Sheet Power.SchDoc
size A; SheetNumber: 5; SheetTotal: 6
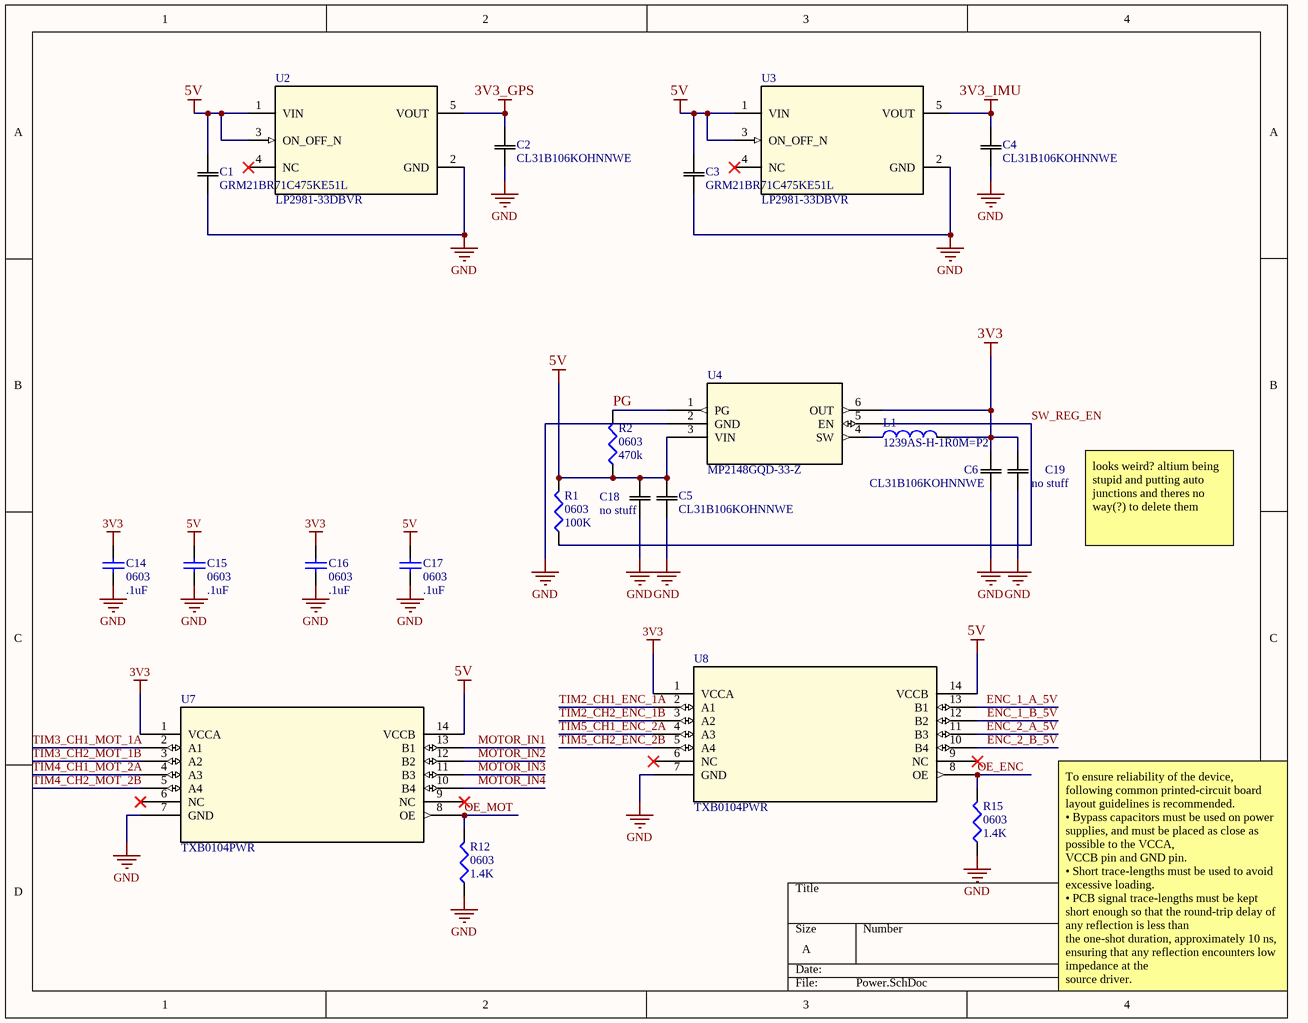
[diagram p4: Power.SchDoc]

### Parts
C1  GRM21BR71C475KE51L  [CAP_GRM0805_2X1P25_MUR]
C2  CL31B106KOHNNWE  [CAP_CL31_SAM]
C3  GRM21BR71C475KE51L  [CAP_GRM0805_2X1P25_MUR]
C4  CL31B106KOHNNWE  [CAP_CL31_SAM]
C5  CL31B106KOHNNWE  [CAP_CL31_SAM]
C6  CL31B106KOHNNWE  [CAP_CL31_SAM]
C14  0603  value .1uF  [1608[0603]]
C15  0603  value .1uF  [1608[0603]]
C16  0603  value .1uF  [1608[0603]]
C17  0603  value .1uF  [1608[0603]]
C18  no stuff  [CAP_CL31_SAM]
C19  no stuff  [CAP_CL31_SAM]
L1  1239AS-H-1R0M=P2  [CAPC10555_55N_KEM]
R1  0603  value 100K  [J1-0603]
R2  0603  value 470k  [J1-0603]
R12  0603  value 1.4K  [J1-0603]
R15  0603  value 1.4K  [J1-0603]
U2  LP2981-33DBVR  [DBV0005A_N]
U3  LP2981-33DBVR  [DBV0005A_N]
U4  MP2148GQD-33-Z  [QFN-1p0x1p5_MNP]
U7  TXB0104PWR  [PW14]
U8  TXB0104PWR  [PW14]

### Nets
3V3: C6.2 C14.2 C16.2 C19.2 L1.2 U4.6(OUT) U7.1(VCCA) U8.1(VCCA)
3V3_GPS: C2.2 U2.5(VOUT)
3V3_IMU: C4.2 U3.5(VOUT)
5V: C1.2 C3.2 C5.2 C15.2 C17.2 C18.2 R1.2 R2.1 U2.1(VIN) U2.3(ON_OFF_N) U3.1(VIN) U3.3(ON_OFF_N) U4.3(VIN) U7.14(VCCB) U8.14(VCCB)
GND: C1.1 C2.1 C3.1 C4.1 C5.1 C6.1 C14.1 C15.1 C16.1 C17.1 C18.1 C19.1 R12.1 R15.1 U2.2(GND) U3.2(GND) U4.2(GND) U7.7(GND) U8.7(GND)
ENC_1_A_5V: U8.13(B1)
ENC_1_B_5V: U8.12(B2)
ENC_2_A_5V: U8.11(B3)
ENC_2_B_5V: U8.10(B4)
MOTOR_IN1: U7.13(B1)
MOTOR_IN2: U7.12(B2)
MOTOR_IN3: U7.11(B3)
MOTOR_IN4: U7.10(B4)
OE_ENC: R15.2 U8.8(OE)
OE_MOT: R12.2 U7.8(OE)
PG: R2.2 U4.1(PG)
SW_REG_EN: R1.1 U4.5(EN)
TIM2_CH1_ENC_1A: U8.2(A1)
TIM2_CH2_ENC_1B: U8.3(A2)
TIM3_CH1_MOT_1A: U7.2(A1)
TIM3_CH2_MOT_1B: U7.3(A2)
TIM4_CH1_MOT_2A: U7.4(A3)
TIM4_CH2_MOT_2B: U7.5(A4)
TIM5_CH1_ENC_2A: U8.4(A3)
TIM5_CH2_ENC_2B: U8.5(A4)
NetL1_1: L1.1 U4.4(SW)

Not connected (* = marked no-connect by the designer): U2 4(NC)*; U3 4(NC)*; U7 6(NC)* 9(NC)*; U8 6(NC)* 9(NC)*

### Notes on the sheet
- looks weird? altium being stupid and putting auto junctions and theres no way(?) to delete them
- To ensure reliability of the device, following common printed-circuit board layout guidelines is recommended.
  • Bypass capacitors must be used on power supplies, and must be placed as close as possible to the VCCA,
  VCCB pin and GND pin.
  • Short trace-lengths must be used to avoid excessive loading.
  • PCB signal trace-lengths must be kept short enough so that the round-trip delay of any reflection is less than
  the one-shot duration, approximately 10 ns, ensuring that any reflection encounters low impedance at the
  source driver.

### Library data of the parts
C1 C3 = GRM21BR71C475KE51L: No Description Available; Mfr_Name: Murata; Type: DEV; Copyright: Copyright (C) 2023 Ultra Librarian. All rights reserved.; Manufacturer_Part_Number: GRM21BR71C475KE51L; Digi-Key_Part_Number_1: 490-14466-2-ND; Digi-Key_Part_Number_2: 490-14466-1-ND; Digi-Key_Part_Number_3: 490-14466-6-ND; RefDes: RefDes
C2 C4-C6 C18 C19 = CL31B106KOHNNWE: No Description Available; Mfr_Name: Samsung; Type: DEV; Copyright: Copyright (C) 2023 Ultra Librarian. All rights reserved.; Manufacturer_Part_Number: CL31B106KOHNNWE; Digi-Key_Part_Number_1: 1276-3105-2-ND; Digi-Key_Part_Number_2: 1276-3105-1-ND; Digi-Key_Part_Number_3: 1276-3105-6-ND; RefDes: RefDes
C14-C17 = Cap Semi: Capacitor (Semiconductor SIM Model); Published: 8-Jun-2000; LatestRevisionDate: 29-May-2009; LatestRevisionNote: IPC-7351 Footprint Added.; PackageReference: C1206; Publisher: Altium Limited; PackageDescription: Chip Capacitor
L1 = 1239AS-H-1R0M=P2: Inductor with Inductance: 1uH Tol. +/-20%, Package: 1008 _2520_; MF: Murata Electronics; SnapEDA_Link: https://www.snapeda.com/parts/1239AS-H-1R0M%3DP2/Murata%20Electronics%20North%20America/view-part/581165/?ref=snap; Digi-Key_Part_Number: 490-10564-1-ND; Value: *; Digi-Key_Purchase_URL: https://www.digikey.com.au/product-detail/en/murata-electronics/1239AS-H-1R0M=P2/490-10564-1-ND/5272022?utm_source=snapeda&utm_medium=aggregator&utm_campaign=symbol; MP: 1239AS-H-1R0M=P2; Package: 2520 Murata
R1 R2 R12 R15 = Res3: Resistor; Published: 8-Jun-2000; LatestRevisionDate: 29-May-2009; LatestRevisionNote: IPC-7351 Footprint Added.; PackageReference: J1-0603; Publisher: Altium Limited; PackageDescription: Chip Resistor
U2 U3 = LP2981-33DBVR: No Description Available; Mfr_Name: Texas Instruments; Type: DEV; RefDes: RefDes; Copyright: Copyright (C) 2023 Ultra Librarian. All rights reserved.; Manufacturer_Part_Number: LP2981-33DBVR; Digi-Key_Part_Number_1: 296-17360-1-ND; Digi-Key_Part_Number_2: 296-17360-2-ND; Digi-Key_Part_Number_3: 296-17360-6-ND; Digi-Key_Part_Number_4: 2156-LP2981-33DBVR-ND
U4 = MP2148GQD-33-Z: No Description Available; Mfr_Name: Monolithic Power Systems; Copyright: Copyright (C) 2023 Ultra Librarian. All rights reserved.; Manufacturer_Part_Number: MP2148GQD-33-Z; Digi-Key_Part_Number_1: MP2148GQD-33-Z-ND; RefDes: RefDes; Type: DEV
U7 U8 = TXB0104PWR: No Description Available; Mfr_Name: Texas Instruments; Copyright: Copyright (C) 2023 Ultra Librarian. All rights reserved.; Manufacturer_Part_Number: TXB0104PWR; Digi-Key_Part_Number_1: 296-21929-1-ND; Digi-Key_Part_Number_2: 296-21929-2-ND; Digi-Key_Part_Number_3: 296-21929-6-ND; RefDes: RefDes; Type: DEV

## Sheet Nucleo.SchDoc
size A; SheetNumber: 6; SheetTotal: 6
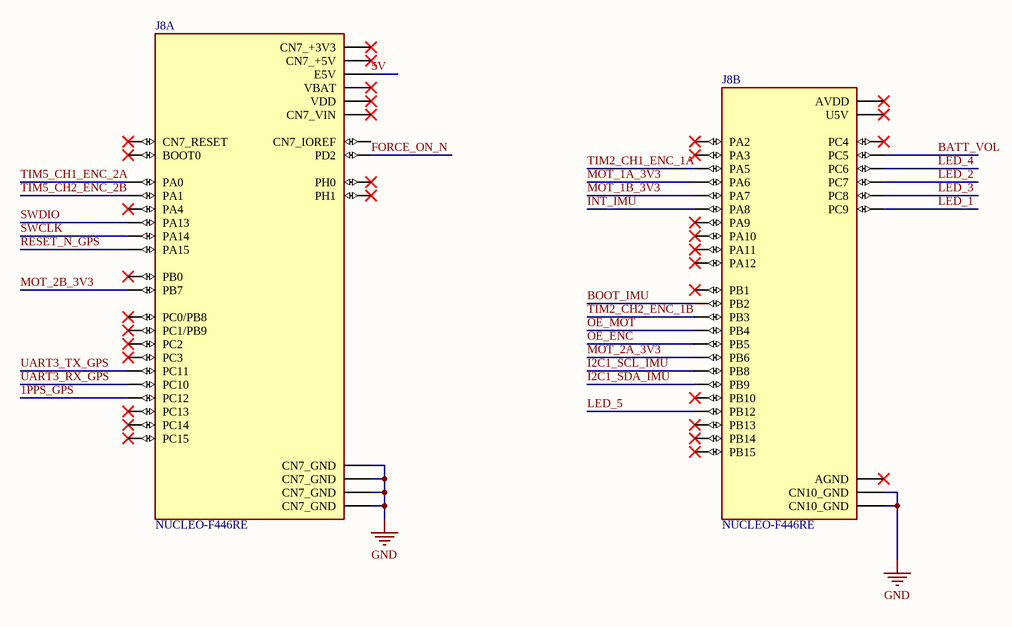
[diagram p5: Nucleo.SchDoc]

### Parts
J8  NUCLEO-F446RE  [MODULE_NUCLEO-F446RE]  (parts A,B of 6)

### Nets
5V: J8.CN7_6(E5V)
GND: J8.CN7_8(CN7_GND) J8.CN7_19(CN7_GND) J8.CN7_20(CN7_GND) J8.CN7_22(CN7_GND) J8.CN10_9(CN10_GND) J8.CN10_20(CN10_GND)
1PPS_GPS: J8.CN7_3(PC12)
BATT_VOL: J8.CN10_6(PC5)
BOOT_IMU: J8.CN10_22(PB2)
FORCE_ON_N: J8.CN7_4(PD2)
I2C1_SCL_IMU: J8.CN10_3(PB8)
I2C1_SDA_IMU: J8.CN10_5(PB9)
INT_IMU: J8.CN10_23(PA8)
LED_1: J8.CN10_1(PC9)
LED_2: J8.CN10_19(PC7)
LED_3: J8.CN10_2(PC8)
LED_4: J8.CN10_4(PC6)
LED_5: J8.CN10_16(PB12)
MOT_1A_3V3: J8.CN10_13(PA6)
MOT_1B_3V3: J8.CN10_15(PA7)
MOT_2A_3V3: J8.CN10_17(PB6)
MOT_2B_3V3: J8.CN7_21(PB7)
OE_ENC: J8.CN10_29(PB5)
OE_MOT: J8.CN10_27(PB4)
RESET_N_GPS: J8.CN7_17(PA15)
SWCLK: J8.CN7_15(PA14)
SWDIO: J8.CN7_13(PA13)
TIM2_CH1_ENC_1A: J8.CN10_11(PA5)
TIM2_CH2_ENC_1B: J8.CN10_31(PB3)
TIM5_CH1_ENC_2A: J8.CN7_28(PA0)
TIM5_CH2_ENC_2B: J8.CN7_30(PA1)
UART3_RX_GPS: J8.CN7_1(PC10)
UART3_TX_GPS: J8.CN7_2(PC11)

Not connected (* = marked no-connect by the designer): J8 CN7_5(VDD)* CN7_7(BOOT0)* CN7_12(CN7_IOREF) CN7_14(CN7_RESET)* CN7_16(CN7_+3V3)* CN7_18(CN7_+5V)* CN7_23(PC13)* CN7_24(CN7_VIN)* CN7_25(PC14)* CN7_27(PC15)* CN7_29(PH0)* CN7_31(PH1)* CN7_32(PA4)* CN7_33(VBAT)* CN7_34(PB0)* CN7_35(PC2)* CN7_36(PC1/PB9)* CN7_37(PC3)* CN7_38(PC0/PB8)* CN10_7(AVDD)* CN10_8(U5V)* CN10_12(PA12)* CN10_14(PA11)* CN10_21(PA9)* CN10_24(PB1)* CN10_25(PB10)* CN10_26(PB15)* CN10_28(PB14)* CN10_30(PB13)* CN10_32(AGND)* CN10_33(PA10)* CN10_34(PC4)* CN10_35(PA2)* CN10_37(PA3)*

### Library data of the parts
J8 = NUCLEO-F446RE: STM32 Nucleo-64 development board with STM32F446RET6 MCU, supports Arduino and ST morpho connectivity; Price: None; MP: NUCLEO-F446RE; Availability: Unavailable; Value: *; Package: None

## Nets that join several sheets
3V3: microController (16 pins), Connectors (J11.10 R35.2), Power (8 pins)
3V3_GPS: Sensor (R22.2 R24.1 U6.6 U6.8), Power (C2.2 U2.5)
3V3_IMU: Sensor (6 pins), Power (C4.2 U3.5)
5V: Connectors (5 pins), Power (15 pins), Nucleo (J8.CN7_6)
GND: microController (19 pins), Connectors (18 pins), Sensor (19 pins), Power (19 pins), Nucleo (6 pins)
1PPS_GPS: microController (U1.53), Sensor (U6.4), Nucleo (J8.CN7_3)
ANT: Connectors (J2.1), Sensor (C12.1 L2.1)
BATT_VOL: microController (U1.25), Connectors (R33.2 R34.1), Nucleo (J8.CN10_6)
BOOT_IMU: microController (U1.28), Sensor (R14.1 U5.4), Nucleo (J8.CN10_22)
D_N: microController (U1.44), Connectors (J6.2)
D_P: microController (U1.45), Connectors (J6.3)
ENC_1_A_5V: Connectors (J3.09), Power (U8.13)
ENC_1_B_5V: Connectors (J3.11), Power (U8.12)
ENC_2_A_5V: Connectors (J4.09), Power (U8.11)
ENC_2_B_5V: Connectors (J4.11), Power (U8.10)
FORCE_ON_N: microController (U1.54), Sensor (R27.2 U6.18), Nucleo (J8.CN7_4)
I2C1_SCL_IMU: microController (R17.1 R18.2), Sensor (U5.19), Nucleo (J8.CN10_3)
I2C1_SDA_IMU: microController (R16.1 R19.2), Sensor (U5.20), Nucleo (J8.CN10_5)
INT_IMU: microController (U1.41), Sensor (U5.14), Nucleo (J8.CN10_23)
LED_1: microController (U1.40), Connectors (R28.1), Nucleo (J8.CN10_1)
LED_2: microController (U1.38), Connectors (R29.1), Nucleo (J8.CN10_19)
LED_3: microController (U1.39), Connectors (R30.1), Nucleo (J8.CN10_2)
LED_4: microController (U1.37), Connectors (R31.1), Nucleo (J8.CN10_4)
LED_5: microController (U1.33), Connectors (R32.1), Nucleo (J8.CN10_16)
MOT_1A_3V3: microController (U1.22), Nucleo (J8.CN10_13)
MOT_1B_3V3: microController (U1.23), Nucleo (J8.CN10_15)
MOT_2A_3V3: microController (U1.58), Nucleo (J8.CN10_17)
MOT_2B_3V3: microController (U1.59), Nucleo (J8.CN7_21)
MOTOR_IN1: Connectors (J5.3), Power (U7.13)
MOTOR_IN2: Connectors (J5.4), Power (U7.12)
MOTOR_IN3: Connectors (J5.5), Power (U7.11)
MOTOR_IN4: Connectors (J5.6), Power (U7.10)
OE_ENC: microController (U1.57), Power (R15.2 U8.8), Nucleo (J8.CN10_29)
OE_MOT: microController (U1.56), Power (R12.2 U7.8), Nucleo (J8.CN10_27)
RESET_N_GPS: microController (U1.50), Sensor (R22.1 U6.9), Nucleo (J8.CN7_17)
SERVO_PWM: microController (U1.43), Connectors (J12.A1)
SWCLK: microController (U1.49), Connectors (J11.7 R38.2), Nucleo (J8.CN7_15)
SWDIO: microController (U1.46), Connectors (J11.9 R35.1), Nucleo (J8.CN7_13)
TIM2_CH1_ENC_1A: microController (U1.21), Power (U8.2), Nucleo (J8.CN10_11)
TIM2_CH2_ENC_1B: microController (U1.55), Power (U8.3), Nucleo (J8.CN10_31)
TIM5_CH1_ENC_2A: microController (U1.14), Power (U8.4), Nucleo (J8.CN7_28)
TIM5_CH2_ENC_2B: microController (U1.15), Power (U8.5), Nucleo (J8.CN7_30)
UART3_RX_GPS: microController (U1.51), Nucleo (J8.CN7_1)
UART3_TX_GPS: microController (U1.52), Nucleo (J8.CN7_2)
VBUS: microController (U1.42), Connectors (J6.1)